# EAGLE design NSE2022_GPSDOWNLINK (EAGLE 9.6.0)
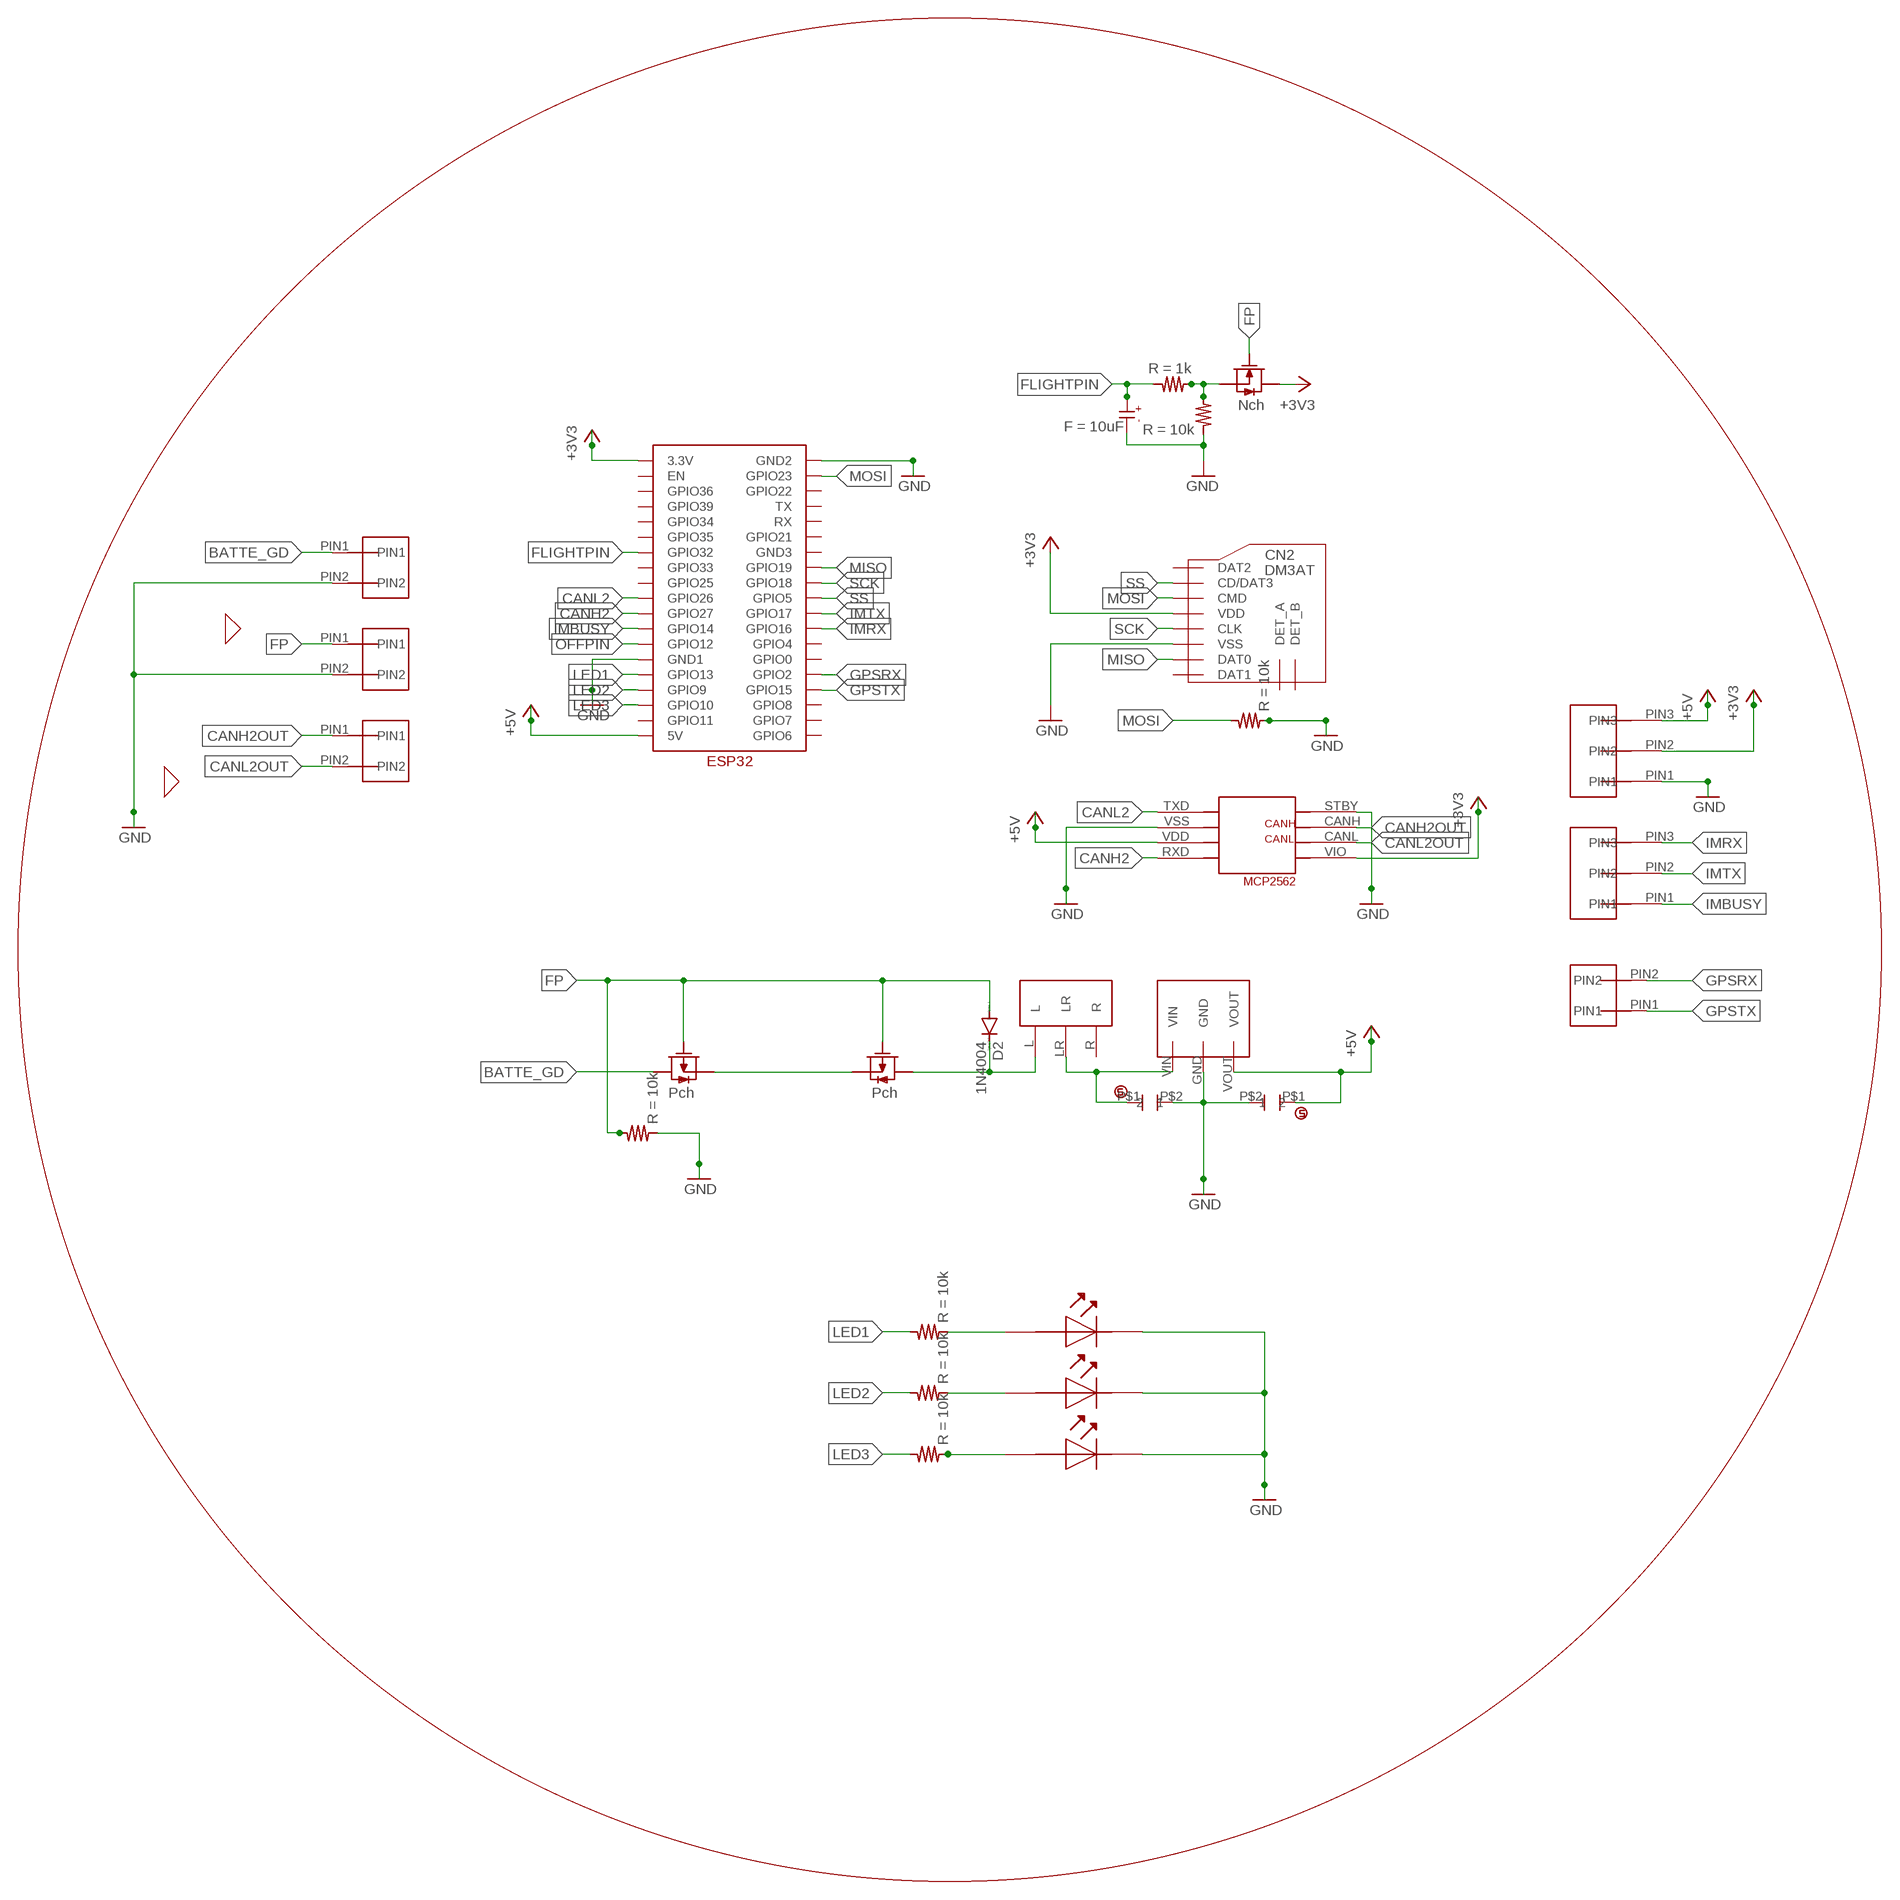
[diagram p0: schematic, sheet 1]

## Parts
C3  CAPACITOR-ELECTROLYTIC_1  [CAPACITOR-ELECTROLYTIC_1]
CERAMIC_CAPACITOR1  CERAMIC_CAPACITOR  [CERAMIC_CAPACITOR]
CERAMIC_CAPACITOR2  CERAMIC_CAPACITOR  [CERAMIC_CAPACITOR]
CN2  DM3AT  [DM3AT]
D2  1N4004  [DO41-10]
R1  RESISTER  [REGISTER]
R2  RESISTER  [REGISTER]
R3  RESISTER  [REGISTER]
R4  RESISTER  [REGISTER]
R7  RESISTER  [REGISTER]
R8  RESISTER  [REGISTER]
R16  RESISTER  [REGISTER]
SRIDE_SWTCH3  SRIDE_SWITCH  [SRIDE_SWITCH]
U$3  2SJ681-PCH  [2SJ681]
U$5  2SJ681-PCH  [2SJ681]
U$6  M78AR05-1  [M78AR05-1]
U$7  2SK4017-NCH  [2SK4017]
U$22  2PIN  [2PIN]
U$23  2PIN  [2PIN]
U$24  2PIN  [2PIN]
U$26  ESP32  [ESP32]
U$28  MCP2562  [MCP2562]
U$29  2PIN  [2PIN]
U$46  3PIN  [3PIN]
U$49  3PIN  [3PIN]
U$55  LED  [LED]
U$70  LED  [LED]
U$71  LED  [LED]

## Nets
+3V3: CN2.VDD U$7.DRAIN U$26.3.3V U$28.VIO U$46.PIN2
+5V: CERAMIC_CAPACITOR1.P$1 U$6.VOUT U$26.5V U$28.VDD U$46.PIN3
BATTE_GD: U$5.DRAIN U$22.PIN1
CANH2: U$26.GPIO27 U$28.RXD
CANH2OUT: U$24.PIN1 U$28.CANH
CANL2: U$26.GPIO26 U$28.TXD
CANL2OUT: U$24.PIN2 U$28.CANL
FLIGHTPIN: C3.KS R8.A U$26.GPIO32
FP: D2.A R3.B U$3.GATE U$5.GATE U$7.GATE U$23.PIN1
GND: C3.AN CERAMIC_CAPACITOR1.P$2 CERAMIC_CAPACITOR2.P$2 CN2.VSS R3.A R4.A R7.A U$6.GND U$22.PIN2 U$23.PIN2 U$26.GND1 U$28.STBY U$28.VSS U$46.PIN1 U$55.PLUS(OUT) U$70.PLUS(OUT) U$71.PLUS(OUT)
GPSRX: U$26.GPIO2 U$29.PIN2
GPSTX: U$26.GPIO15 U$29.PIN1
IMBUSY: U$26.GPIO14 U$49.PIN1
IMRX: U$26.GPIO16 U$49.PIN3
IMTX: U$26.GPIO17 U$49.PIN2
LED1: R1.B U$26.GPIO13
LED2: R2.B U$26.GPIO9
LED3: R16.B U$26.GPIO10
MISO: CN2.DAT0 U$26.GPIO19
MOSI: CN2.CMD R4.B U$26.GPIO23
N$1: U$26.GND2 ; supply symbol labelled GND
N$3: U$3.SOURCE U$5.SOURCE
N$4: CERAMIC_CAPACITOR2.P$1 SRIDE_SWTCH3.LR U$6.VIN
N$9: R7.B R8.B U$7.SOURCE
N$12: D2.C SRIDE_SWTCH3.L U$3.DRAIN
N$14: R1.A U$55.MINUS(IN)
N$18: R2.A U$70.MINUS(IN)
N$19: R16.A U$71.MINUS(IN)
OFFPIN: U$26.GPIO12
SCK: CN2.CLK U$26.GPIO18
SS: CN2.CD/DAT3 U$26.GPIO5
Unconnected: CN2.DAT1 CN2.DAT2 CN2.DET_A CN2.DET_B SRIDE_SWTCH3.R U$26.EN U$26.GND3 U$26.GPIO0 U$26.GPIO4 U$26.GPIO6 U$26.GPIO7 U$26.GPIO8 U$26.GPIO11 U$26.GPIO21 U$26.GPIO22 U$26.GPIO25 U$26.GPIO33 U$26.GPIO34 U$26.GPIO35 U$26.GPIO36 U$26.GPIO39 U$26.RX U$26.TX

## Library data of the parts
C3 = normal capacitor:CAPACITOR-ELECTROLYTIC_1; F: 10uF
CERAMIC_CAPACITOR1 CERAMIC_CAPACITOR2 = capacitor:CERAMIC_CAPACITOR: ceramic_capacitor
CN2 = microSD:DM3AT
D2 = diode:1N4004: DIODE general purpose rectifier, 1 A
R1-R4 R7 R16 = normal register:RESISTER; R: 10k
R8 = normal register:RESISTER; R: 1k
SRIDE_SWTCH3 = Switches:SRIDE_SWITCH
U$3 U$5 = MOSFET:2SJ681-PCH
U$6 = M78AR05-1:M78AR05-1
U$7 = MOSFET:2SK4017-NCH
U$22-U$24 U$29 = 2PIN:2PIN
U$26 = ESP32:ESP32
U$28 = MCP2562:MCP2562
U$46 U$49 = 3PIN:3PIN
U$55 U$70 U$71 = LEDkato:LED

## Board
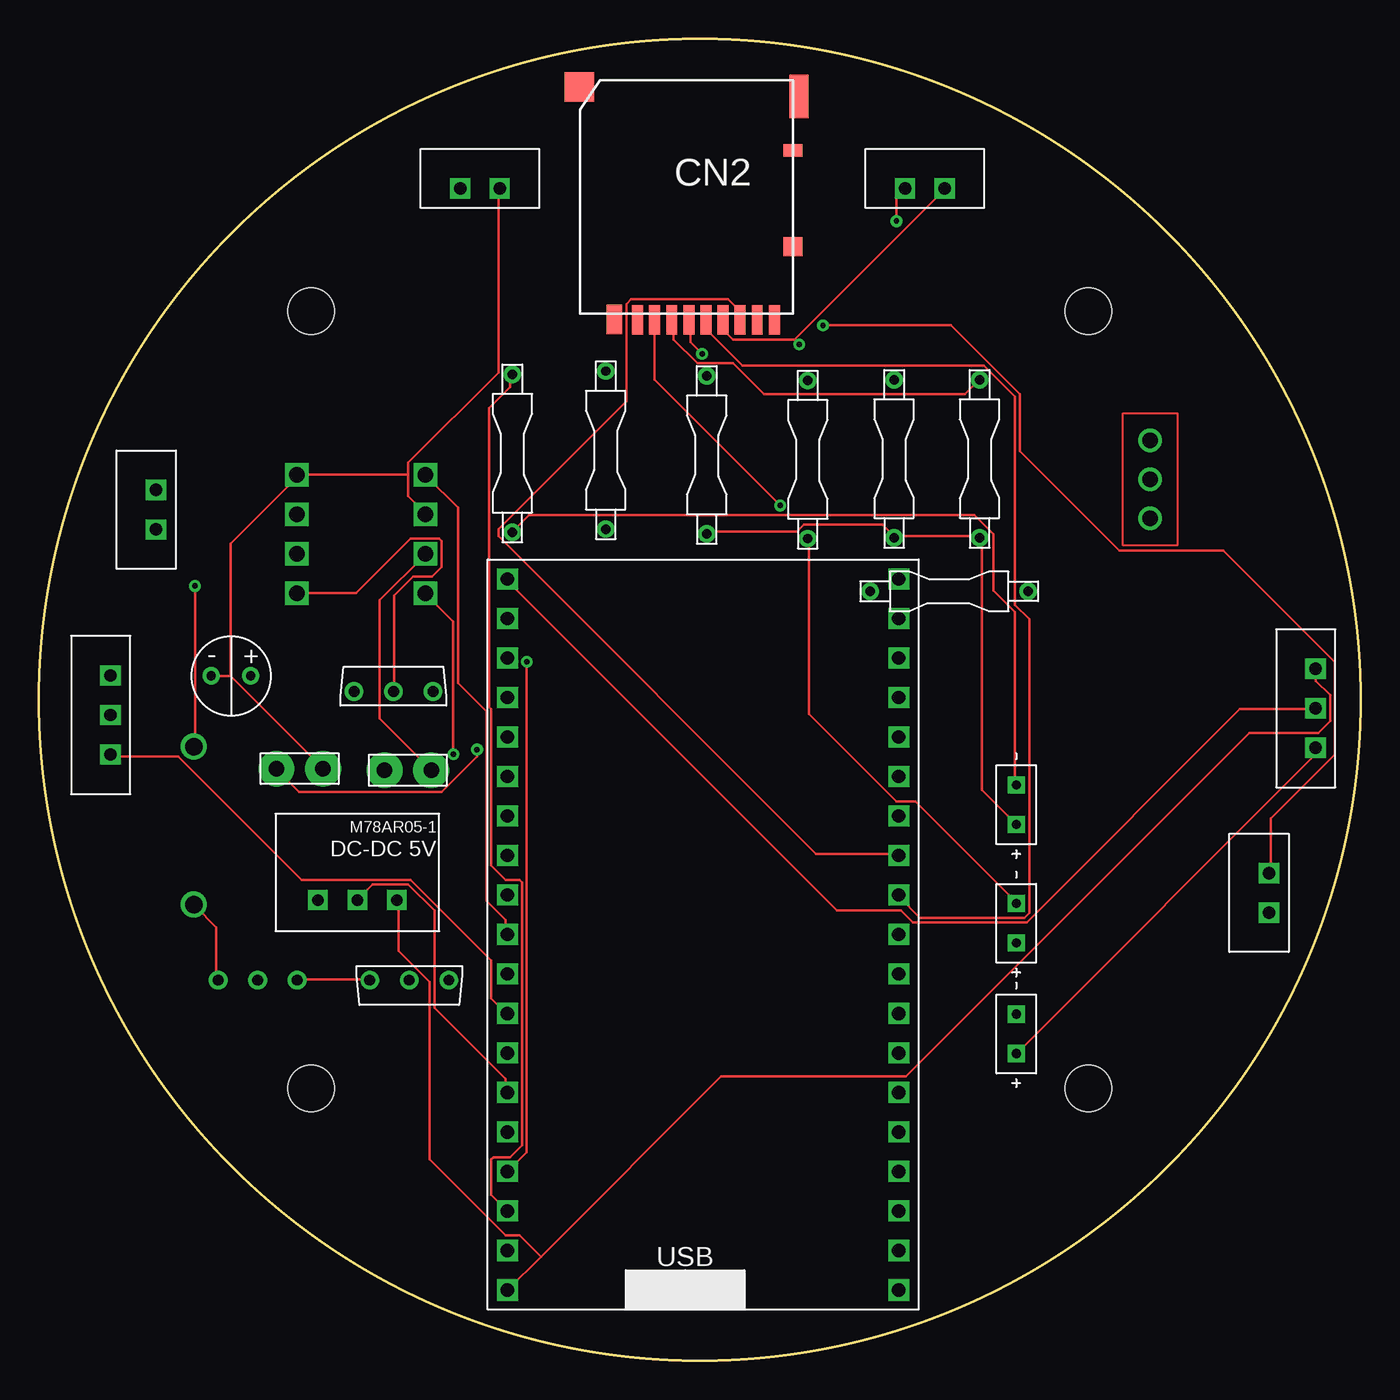
[diagram p1: board, top side]
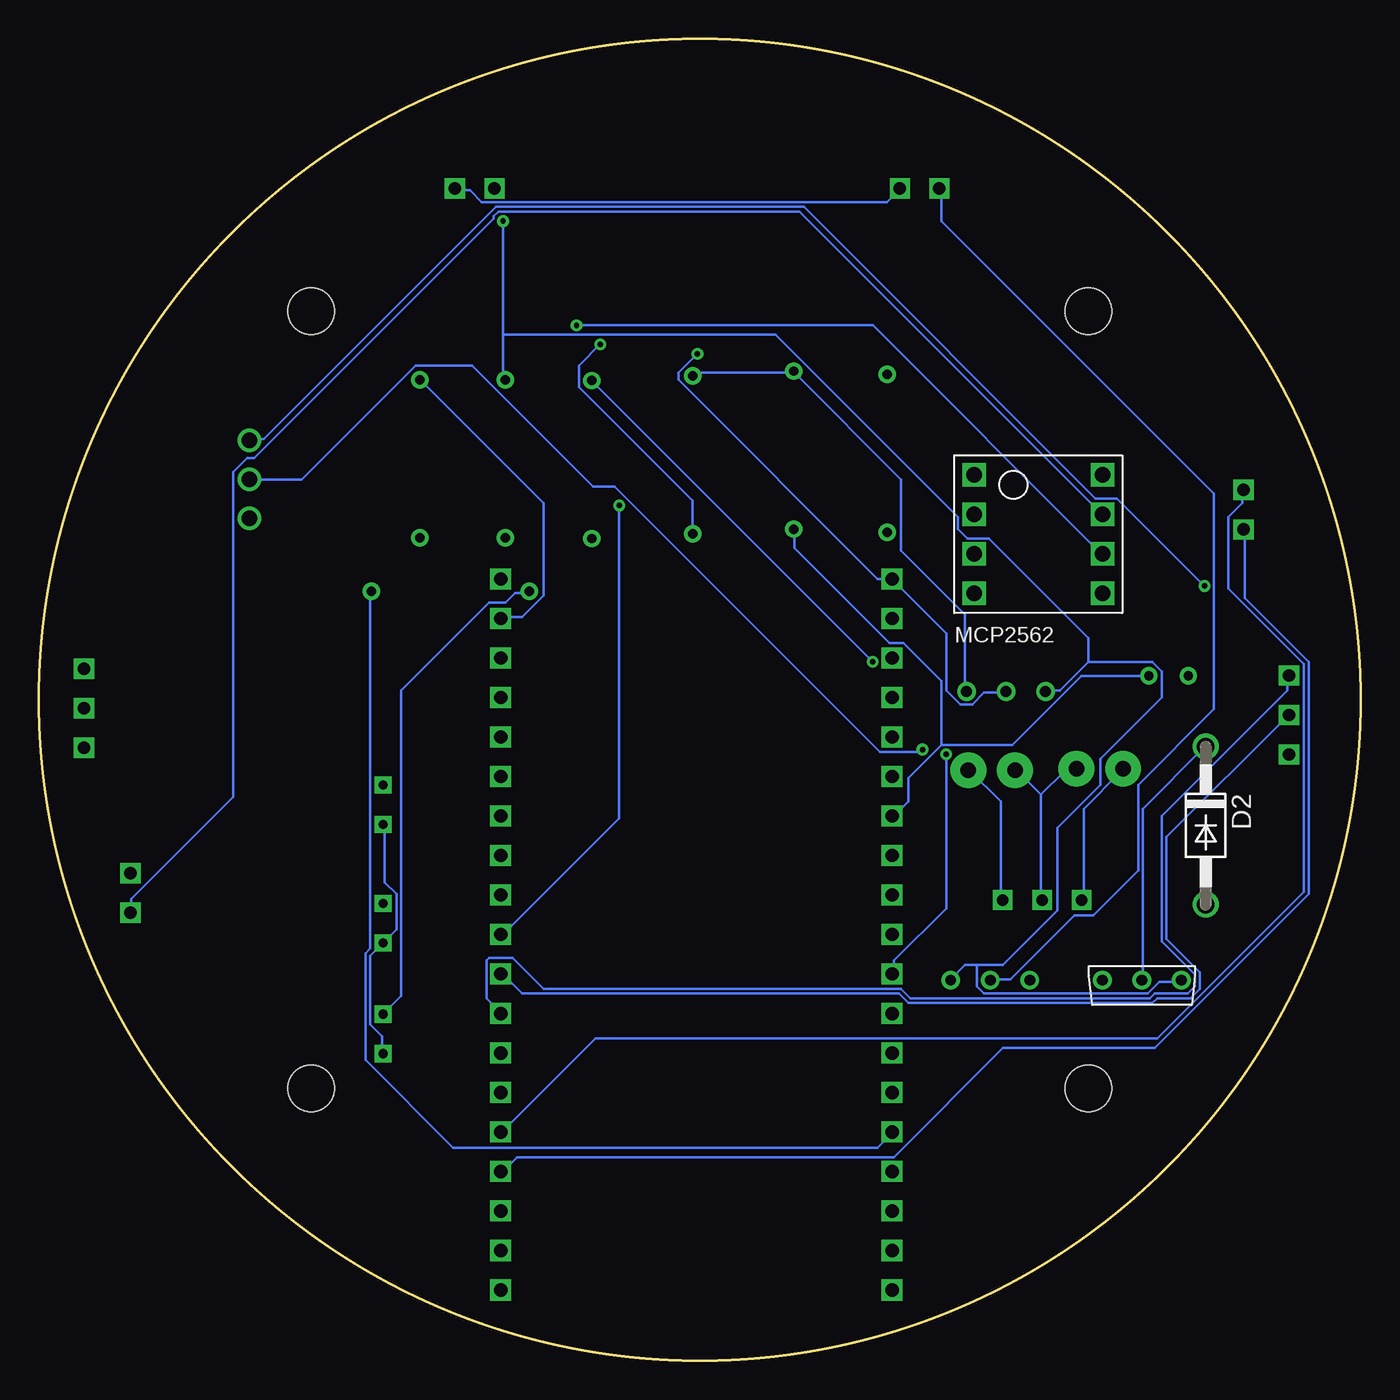
[diagram p2: board, bottom side, seen from below]

Size 85.01 x 85.01 mm. Coordinates in mm from the lower left corner, seen from the top.
Outline: circle at 42.5,42.5 radius 42.5
Copper layers (1*16): Top 0.035mm / dielectric 1.5mm / Bottom 0.035mm
Design rules "default": minimum track width 6mil, minimum drill 0.35mm, track to track 6mil, track to pad 6mil, pad to pad 6mil, via to via 6mil, smd to smd 6mil, copper to edge 40mil, drill to drill 6mil, minimum pad ring 10mil, minimum via ring 8mil, stop-mask expansion 4mil, vias tented up to drill 0mil, thermal gap 10mil
Holes 3 mm at 67.5,67.5 17.5,67.5 67.5,17.5 17.5,17.5

### Footprints (pad centres in the part's own frame; a part is rotated, then mirrored left to right if it is on the bottom)
CAPACITOR-ELECTROLYTIC_1 = drill 0.6: AN -1.27,0; KS 1.27,0
CERAMIC_CAPACITOR = drill 1 pad 2.3: P$1 0,0; P$2 0,3
DM3AT = smd 0.7 x 1.9: CD/DAT3 2.2,6.4; CLK -1.1,6.4; CMD 1.1,6.4; DAT0 -3.3,6.4; DAT1 -4.4,6.4; DAT2 3.3,6.4; DET_B -5.5,6.4; VDD 0,6.4; VSS -2.2,6.4 | smd 1.2 x 0.8: DET_A -6.7,-4.5 | smd 1 x 1.9: P$9 4.8,6.381 | smd 1.2 x 1.2: P$11 -6.7,1.7 | smd 1.2 x 2.8: P$13 -7.081,-7.973 | smd 1.9 x 1.9: P$14 7.054,-8.562
DO41-10 = drill 1.118: A 5.08,0; C -5.08,0
REGISTER = drill 0.6: A -5.08,0; B 5.08,0
SRIDE_SWITCH = drill 1: L -2.5,0; LR 0,0; R 2.5,0
2SJ681 = drill 0.7: DRAIN 0,0; GATE 2.54,0; SOURCE -2.54,0
M78AR05-1 = drill 0.75 pad 1.27 square: GND 0,0; VIN 2.54,0; VOUT -2.54,0
2SK4017 = drill 0.7: DRAIN 0,0; GATE 2.54,0; SOURCE -2.54,0
2PIN = drill 0.8 square: PIN1 1.27,0; PIN2 3.81,0
ESP32 = drill 0.85 square: 3.3V 1.27,46.99; 5V 1.27,1.27; EN 1.27,44.45; GND1 1.27,13.97; GND2 26.44,46.99; GND3 26.44,31.75; GPIO0 26.44,13.97; GPIO2 26.44,11.43; GPIO4 26.44,16.51; GPIO5 26.44,24.13; GPIO6 26.44,1.27; GPIO7 26.44,3.81; GPIO8 26.44,6.35; GPIO9 1.27,8.89; GPIO10 1.27,6.35; GPIO11 1.27,3.81; GPIO12 1.27,16.51; GPIO13 1.27,11.43; GPIO14 1.27,19.05; GPIO15 26.44,8.89; GPIO16 26.44,19.05; GPIO17 26.44,21.59; GPIO18 26.44,26.67; GPIO19 26.44,29.21; GPIO21 26.44,34.29; GPIO22 26.44,41.91; GPIO23 26.44,44.45; GPIO25 1.27,26.67; GPIO26 1.27,24.13; GPIO27 1.27,21.59; GPIO32 1.27,31.75; GPIO33 1.27,29.21; GPIO34 1.27,36.83; GPIO35 1.27,34.29; GPIO36 1.27,41.91; GPIO39 1.27,39.37; RX 26.44,36.83; TX 26.44,39.37
MCP2562 = drill 1 square: CANH 8.255,6.35; CANL 8.255,3.81; RXD 0,1.27; STBY 8.255,8.89; TXD 0,8.89; VDD 0,3.81; VIO 8.255,1.27; VSS 0,6.35
3PIN = drill 0.8 square: PIN1 1.27,0; PIN2 3.81,0; PIN3 6.35,0
LED = drill 0.6 square: MINUS 1.27,0; PLUS 3.81,0

### Placement (x,y rotation side)
C3  12.35,44.04 0 top
CERAMIC_CAPACITOR1  25.23,37.97 90 top
CERAMIC_CAPACITOR2  15.27,38.07 270 top
CN2  41.8,73.34 180 top
D2  9.96,34.41 270 bottom
R1  58.54,49.47 0 top
R2  49.45,57.95 90 top
R3  55,58 90 top
R4  60.5,58 90 top
R7  42.95,58.25 90 top
R8  36.45,58.55 90 top
R16  30.45,58.35 90 top
SRIDE_SWTCH3  71.47,56.67 270 top
U$3  14.06,24.47 0 bottom
U$5  23.82,24.47 0 top
U$6  20.48,29.62 180 top
U$7  22.8,43.03 180 top
U$22  25.82,75.39 0 top
U$23  54.43,75.39 0 top
U$24  79.11,27.54 90 top
U$26  28.86,3.27 0 top
U$28  24.86,48.07 0 bottom
U$29  7.53,52.18 90 top
U$46  82.11,38.14 90 top
U$49  4.61,37.71 90 top
U$55  62.86,23.55 270 top
U$70  62.86,30.67 270 top
U$71  62.86,38.29 270 top

### Tracks (layer width: path | path; a pad name or v marks a point on that pad's centre or on a via)
+3V3  (via drill 0.35)
  Top 0.152: v42.65,64.75 41.89,65.51 41.89,66.89 CN2.VDD | U$46.PIN2 81.97,41.89 77.25,41.89 63.53,28.18 56.22,28.18 55.46,28.94 51.34,28.94 30.16,50.12 U$26.3.3V | U$28.VIO 16.75,49.36 20.4,49.36 23.91,52.87 25.74,52.87 25.89,52.71 25.89,51.04 25.28,50.43 24.06,50.43 22.84,49.21 22.84,43.11 U$7.DRAIN
  Bottom 0.152: v42.65,64.75 43.87,63.53 43.87,63.08 31.07,50.27 30.16,50.27 U$26.3.3V 30.01,50.12 26.65,46.77 26.65,43.11 25.74,42.2 24.98,42.2 24.21,42.96 22.84,42.96 U$7.DRAIN
+5V
  Top 0.152: U$28.VDD 24.82,51.8 21.93,48.9 21.93,41.28 25.13,38.08 CERAMIC_CAPACITOR1.P$1 | 32.29,6.69 30.16,4.55 U$26.5V | 32.29,6.69 43.87,18.27 55.76,18.27 77.86,40.37 82.28,40.37 83.04,41.13 83.04,42.81 82.13,43.72 82.13,44.48 U$46.PIN3 | 32.29,6.69 30.92,8.06 30.01,8.06 25.13,12.94 25.13,24.37 23.15,26.35 23.15,29.55 U$6.VOUT
  Bottom 0.152: U$6.VOUT 23.15,29.7 23.15,35.95 25.13,37.93 CERAMIC_CAPACITOR1.P$1
BATTE_GD
  Bottom 0.152: U$5.DRAIN 23.76,24.52 22.54,24.52 18.42,28.63 17.2,28.63 14.31,31.53 14.31,37.02 9.43,41.89 9.43,55.76 26.96,73.29 26.96,75.27 U$22.PIN1
CANH2  (via drill 0.35)
  Top 0.152: v26.65,39 26.65,47.53 24.98,49.21 U$28.RXD
  Bottom 0.152: v26.65,39 26.65,29.09 30.01,25.74 30.01,24.98 U$26.GPIO27
CANH2OUT
  Bottom 0.152: U$24.PIN1 79.08,28.94 79.08,29.7 72.53,36.25 72.53,57.13 71.61,58.05 71.15,58.05 55.76,73.44 55.76,73.59 55.46,73.9 36.1,73.9 16.75,54.54 U$28.CANH
CANL2
  Top 0.152: U$26.GPIO26 30.01,27.41 30.01,28.33 28.79,29.55 28.79,41.74 26.96,43.57 26.96,54.85 24.98,56.83 U$28.TXD
CANL2OUT  (via drill 0.35)
  Top 0.152: v50.43,66.58 58.66,66.58 63.08,62.16 63.08,58.5 69.48,52.1 76.18,52.1 83.35,44.94 83.35,39 79.23,34.88 79.23,31.38 U$24.PIN2
  Bottom 0.152: v50.43,66.58 31.38,66.58 16.75,51.95 U$28.CANL
FLIGHTPIN
  Bottom 0.152: 26.96,39.61 22.39,39.61 17.97,44.03 13.7,44.03 C3.KS | 26.96,39.61 29.09,37.47 29.09,35.95 30.01,35.03 U$26.GPIO32 | 26.96,39.61 26.96,43.72 29.4,46.16 30.31,46.16 36.41,52.26 36.41,53.32 R8.A
FP  (via drill 0.35)
  Top 0.152: v55.15,73.29 55.15,74.81 55.61,75.27 U$23.PIN1 | U$3.GATE 11.41,24.52 11.41,27.87 10.04,29.24 D2.A
  Bottom 0.152: v55.15,73.29 55.15,65.97 | 55.15,65.97 55.15,63.23 R3.B | 17.51,44.94 19.34,43.11 20.25,43.11 U$7.GATE | 17.51,44.94 13.39,44.94 12.78,44.33 12.78,42.65 16.75,38.69 16.75,37.02 19.49,34.27 19.49,28.94 23,25.43 24.67,25.43 | 24.67,25.43 25.43,25.43 26.35,24.52 U$5.GATE | 24.67,25.43 24.67,24.06 24.21,23.6 13.7,23.6 12.94,24.37 11.57,24.37 U$3.GATE | 55.15,65.97 37.63,65.97 25.89,54.24 25.89,53.48 25.28,52.87 23.91,52.87 17.51,46.46 17.51,44.94
GND  (via drill 0.35)
  Top 0.152: R7.A 42.96,53.32 48.75,53.32 49.21,53.78 54.24,53.78 55,53.02 R3.A 55.15,53.02 60.49,53.02 R4.A 60.64,52.87 60.64,36.71 62.77,34.58 U$71.PLUS | U$46.PIN1 81.97,39.3 81.97,38.84 62.92,19.79 U$55.PLUS | 12.33,44.03 11.11,44.03 C3.AN | 12.33,44.03 CERAMIC_CAPACITOR2.P$2 | U$26.GND1 30.01,17.36 30.01,18.12 25.43,22.69 25.43,28.94 23.76,30.62 21.47,30.62 20.56,29.7 U$6.GND | 48.6,65.67 44.64,65.67 44.03,66.28 44.03,66.89 CN2.VSS | 48.6,65.67 58.2,75.27 U$23.PIN2 | 23.76,56.98 23.76,55.61 24.82,54.54 U$28.VSS | 23.76,56.98 23.76,57.74 29.55,63.53 29.55,75.27 U$22.PIN2 | 23.76,56.98 16.75,56.98 U$28.STBY 16.59,56.83 12.33,52.56 12.33,44.03 | 48.6,65.67 v48.9,65.36
  Bottom 0.152: U$55.PLUS 62.92,19.79 62.92,20.86 63.69,21.62 63.69,26.04 62.92,26.81 U$70.PLUS 62.77,26.96 62.01,27.72 62.01,30.01 62.77,30.77 62.77,34.43 U$71.PLUS | 20.56,36.41 20.56,29.7 U$6.GND | 20.56,36.41 22.08,37.93 CERAMIC_CAPACITOR1.P$2 | 20.56,36.41 19.03,37.93 18.42,37.93 CERAMIC_CAPACITOR2.P$2 | U$23.PIN2 58.2,75.27 57.29,75.27 56.52,74.51 30.46,74.51 29.7,75.27 U$22.PIN2 | v48.9,65.36 50.27,63.99 50.27,62.62 42.96,55.3 42.96,53.32 R7.A
GPSRX
  Bottom 0.152: U$29.PIN2 7.6,55.91 7.6,55.15 8.52,54.24 8.52,49.67 3.64,44.79 3.64,30.16 13.09,20.71 49.21,20.71 55.15,14.77 U$26.GPIO2
GPSTX
  Bottom 0.152: U$29.PIN1 7.45,53.32 7.45,49.06 3.34,44.94 3.34,30.01 13.24,20.1 23,20.1 30.01,13.09 54.24,13.09 55.15,12.17 U$26.GPIO15
IMBUSY
  Top 0.152: U$49.PIN1 4.71,38.84 8.97,38.84 16.9,30.92 23.91,30.92 29.09,25.74 29.09,23.3 30.01,22.39 U$26.GPIO14
IMRX
  Bottom 0.152: U$49.PIN3 4.71,44.03 4.71,43.11 12.78,35.03 12.78,26.96 10.65,24.82 10.65,24.06 11.11,23.6 13.24,23.6 13.55,23.3 28.94,23.3 29.55,23.91 52.56,23.91 54.54,25.89 56.07,25.89 56.22,25.74 56.22,23.3 55.3,22.39 U$26.GPIO16
IMTX
  Bottom 0.152: U$49.PIN2 4.71,41.44 12.48,33.66 12.48,27.11 10.35,24.98 10.35,23.91 10.96,23.3 13.09,23.3 13.39,23 29.09,23 29.7,23.6 53.93,23.6 55.15,24.82 U$26.GPIO17
LED1
  Bottom 0.152: R1.B 63.69,49.36 63.69,26.5 63.99,26.2 63.99,19.34 58.35,13.7 31.07,13.7 30.16,14.61 U$26.GPIO13
LED2  (via drill 0.35)
  Top 0.152: v31.38,44.94 31.38,13.39 30.16,12.17 U$26.GPIO9
  Bottom 0.152: v31.38,44.94 49.36,62.92 R2.B
LED3
  Top 0.152: R16.B 30.31,63.38 30.31,62.62 28.94,61.25 28.94,42.05 29.09,41.89 29.09,31.83 30.01,30.92 30.92,30.92 31.07,30.77 31.07,13.85 30.31,13.09 29.24,13.09 29.09,12.94 29.09,10.65 30.01,9.74 U$26.GPIO10
MISO
  Top 0.152: CN2.DAT0 45.09,67.04 45.09,67.5 44.33,68.26 38.08,68.26 37.78,67.95 37.78,61.7 29.55,53.48 29.55,53.02 49.97,32.6 55.15,32.6 U$26.GPIO19
MOSI
  Top 0.152: CN2.CMD 40.83,66.89 40.83,65.67 42.35,64.14 44.64,64.14 46.62,62.16 59.57,62.16 60.49,63.08 R4.B
  Bottom 0.152: U$26.GPIO23 55.15,47.84 53.93,47.84 52.56,49.21 52.56,55.15 60.49,63.08 R4.B
N$3
  Top 0.152: U$3.SOURCE 16.75,24.52 21.17,24.52 U$5.SOURCE
N$4  (via drill 0.35)
  Top 0.152: v28.18,39.3 28.18,38.84 25.89,36.56 16.75,36.56 15.38,37.93 CERAMIC_CAPACITOR2.P$1
  Bottom 0.152: U$6.VIN 17.81,29.7 17.81,35.49 15.38,37.93 CERAMIC_CAPACITOR2.P$1 | v28.18,39.3 28.33,39.15 30.92,39.15 47.99,56.22 49.36,56.22 57.13,63.99 60.79,63.99 68.11,56.68 71.46,56.68 SRIDE_SWTCH3.LR
N$9
  Bottom 0.152: R7.B 42.81,63.38 42.65,63.53 36.56,63.53 R8.B 36.41,63.53 29.55,56.68 29.55,52.1 25.43,47.99 25.43,43.11 U$7.SOURCE
N$12  (via drill 0.35)
  Top 0.152: v10.04,49.82 10.04,39.61 D2.C
  Bottom 0.152: U$3.DRAIN 14,24.52 14,35.49 10.04,39.45 D2.C | v10.04,49.82 15.68,55.46 17.05,55.46 35.8,74.2 55.61,74.2 70.54,59.27 71.46,59.27 SRIDE_SWTCH3.L
N$14
  Bottom 0.152: R1.A 53.48,49.36 54.39,49.36 55,48.75 56.07,48.75 61.7,43.11 61.7,23.45 62.77,22.39 U$55.MINUS
N$18
  Top 0.152: R2.A 49.51,52.87 49.51,41.59 55.15,35.95 56.37,35.95 62.77,29.55 U$70.MINUS
N$19
  Top 0.152: U$71.MINUS 62.77,37.17 62.77,48.14 61.4,49.51 61.4,53.17 60.18,54.39 31.53,54.39 30.46,53.32 R16.A
SCK
  Top 0.152: CN2.CLK 42.96,66.89 42.96,66.28 45.25,63.99 60.79,63.99 62.77,62.01 62.77,48.6 63.69,47.68 63.69,28.79 63.38,28.48 56.68,28.48 55.3,29.85 U$26.GPIO18
SS  (via drill 0.35)
  Top 0.152: v47.68,55 39.61,63.08 39.61,66.89 CN2.CD/DAT3
  Bottom 0.152: v47.68,55 47.68,34.88 55.15,27.41 U$26.GPIO5